# EAGLE design eGH (EAGLE 9.6.2)
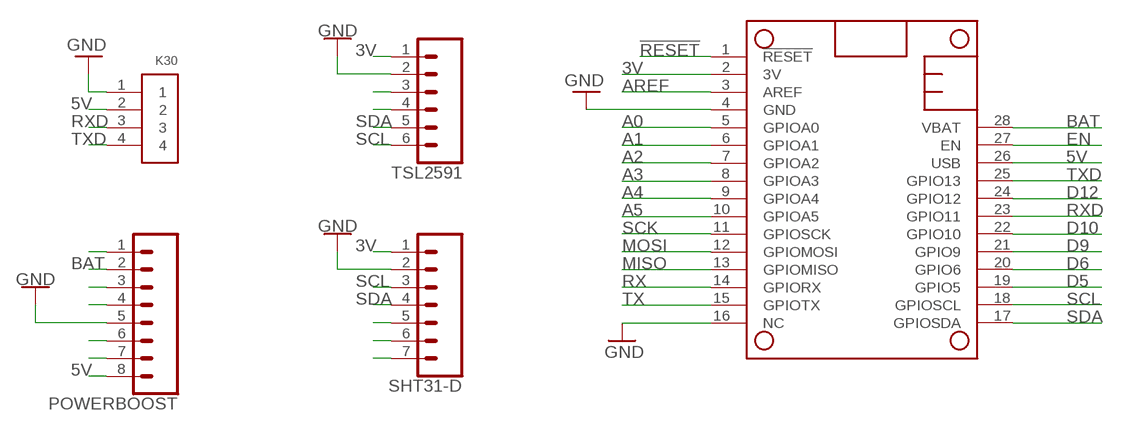
[diagram p0: schematic, sheet 1]

## Parts
K30  1X4-BIG  [1X04-BIG]
MS1  FEATHERWING  [FEATHERWING]
POWERBOOST  CONN_08"  [1X08]
SHT31-D  CONN_07  [1X07]
TSL2591  CONN_06SILK_FEMALE_PTH  [1X06]

## Nets
3V: MS1.2(3V) SHT31-D.1 TSL2591.1
5V [Power]: K30.2 MS1.26(USB) POWERBOOST.8
!RESET: MS1.1(!RESET)
A0: MS1.5(GPIOA0)
A1: MS1.6(GPIOA1)
A2: MS1.7(GPIOA2)
A3: MS1.8(GPIOA3)
A4: MS1.9(GPIOA4)
A5: MS1.10(GPIOA5)
AREF: MS1.3(AREF)
BAT: MS1.28(VBAT) POWERBOOST.2
D5: MS1.19(GPIO5)
D6: MS1.20(GPIO6)
D9: MS1.21(GPIO9)
D10: MS1.22(GPIO10)
D12: MS1.24(GPIO12)
EN: MS1.27(EN)
GND [Power]: K30.1 MS1.4(GND) POWERBOOST.5 SHT31-D.2 TSL2591.2
MISO: MS1.13(GPIOMISO)
MOSI: MS1.12(GPIOMOSI)
N$1: POWERBOOST.1
N$2: MS1.16(NC) ; supply symbol labelled GND
N$3: TSL2591.3
N$4: TSL2591.4
N$5: POWERBOOST.3
N$6: POWERBOOST.4
N$7: SHT31-D.5
N$8: SHT31-D.6
N$9: SHT31-D.7
N$11: POWERBOOST.6
N$12: POWERBOOST.7
RX: MS1.14(GPIORX)
RXD: K30.3 MS1.23(GPIO11)
SCK: MS1.11(GPIOSCK)
SCL: MS1.18(GPIOSCL) SHT31-D.3 TSL2591.6
SDA: MS1.17(GPIOSDA) SHT31-D.4 TSL2591.5
TX: MS1.15(GPIOTX)
TXD: K30.4 MS1.25(GPIO13)

## Library data of the parts
K30 = adafruit:1X4: 4-pin connector
MS1 = adafruit:FEATHERWING
POWERBOOST = SparkFun-Connectors:CONN_08: Multi connection point. Often used as Generic Header-pin footprint for 0.1 inch spaced/style header connections On any of the 0.1 inch spaced packages, you can populate with these: Break Away Headers - Straight <https://www.sparkfun.com/products/116> (PRT-00116) Break Away Male Headers - Right Angle <https://www.sparkfun.com/products/553> (PRT-00553) Female Headers <https://www.sparkfun.com/products/115> (PRT-00115) Break Away Headers - Machine Pin <https://www.sparkfun.com/products/117> (PRT-00117) Break Away Female Headers - Swiss Machine Pin <https://www.sparkfun.com/products/743> (PRT-00743) Arduino Stackable Header - 8 Pin <https://www.sparkfun.com/products/9279> (PRT-09279) For SCREWTERMINALS and SPRING TERMINALS visit here: Screw Terimnals on SparkFun.com <https://www.sparkfun.com/search/results?term=Screw+Terminals> (5mm/3.5mm/2.54mm spacing) This device is also useful as a general connection point to wire up your design to another part of your project. Our various solder wires solder well into these plated through hole pads. Hook-Up Wire - Assortment (Stranded, 22 AWG) <https://www.sparkfun.com/products/11375> (PRT-11375) Hook-Up Wire - Assortment (Solid Core, 22 AWG) <https://www.sparkfun.com/products/11367> (PRT-11367) View the entire wire category on our website here <https://www.sparkfun.com/categories/141> Special notes: Molex polarized connector foot print use with SKU : PRT-08231 with associated crimp pins and housings. 1MM SMD Version SKU: PRT-10208 NOTES ON THE VARIANTS LOCK and LOCK_LONGPADS... This footprint was designed to help hold the alignment of a through-hole component (i.e. 6-pin header) while soldering it into place. You may notice that each hole has been shifted either up or down by 0.005 of an inch from it's more standard position (which is a perfectly straight line). This slight alteration caused the pins (the squares in the middle) to touch the edges of the holes. Because they are alternating, it causes a "brace" to hold the component in place. 0.005 has proven to be the perfect amount of "off-center" position when using our standard breakaway headers. Although looks a little odd when you look at the bare footprint, once you have a header in there, the alteration is very hard to notice. Also,if you push a header all the way into place, it is covered up entirely on the bottom side.; PROD_ID: CONN-08438
SHT31-D = SparkFun-Connectors:CONN_07: Multi connection point. Often used as Generic Header-pin footprint for 0.1 inch spaced/style header connections On any of the 0.1 inch spaced packages, you can populate with these: Break Away Headers - Straight <https://www.sparkfun.com/products/116> (PRT-00116) Break Away Male Headers - Right Angle <https://www.sparkfun.com/products/553> (PRT-00553) Female Headers <https://www.sparkfun.com/products/115> (PRT-00115) Break Away Headers - Machine Pin <https://www.sparkfun.com/products/117> (PRT-00117) Break Away Female Headers - Swiss Machine Pin <https://www.sparkfun.com/products/743> (PRT-00743) For SCREWTERMINALS and SPRING TERMINALS visit here: Screw Terimnals on SparkFun.com <https://www.sparkfun.com/search/results?term=Screw+Terminals> (5mm/3.5mm/2.54mm spacing) This device is also useful as a general connection point to wire up your design to another part of your project. Our various solder wires solder well into these plated through hole pads. Hook-Up Wire - Assortment (Stranded, 22 AWG) <https://www.sparkfun.com/products/11375> (PRT-11375) Hook-Up Wire - Assortment (Solid Core, 22 AWG) <https://www.sparkfun.com/products/11367> (PRT-11367) View the entire wire category on our website here <https://www.sparkfun.com/categories/141> Special notes: Molex polarized connector foot print use with SKU : PRT-08231 with associated crimp pins and housings. 1MM SMD Version SKU: PRT-10208 NOTES ON THE VARIANTS LOCK and LOCK_LONGPADS... This footprint was designed to help hold the alignment of a through-hole component (i.e. 6-pin header) while soldering it into place. You may notice that each hole has been shifted either up or down by 0.005 of an inch from it's more standard position (which is a perfectly straight line). This slight alteration caused the pins (the squares in the middle) to touch the edges of the holes. Because they are alternating, it causes a "brace" to hold the component in place. 0.005 has proven to be the perfect amount of "off-center" position when using our standard breakaway headers. Although looks a little odd when you look at the bare footprint, once you have a header in there, the alteration is very hard to notice. Also,if you push a header all the way into place, it is covered up entirely on the bottom side.
TSL2591 = SparkFun-Connectors:CONN_06: Multi connection point. Often used as Generic Header-pin footprint for 0.1 inch spaced/style header connections On any of the 0.1 inch spaced packages, you can populate with these: Break Away Headers - Straight <https://www.sparkfun.com/products/116> (PRT-00116) Break Away Male Headers - Right Angle <https://www.sparkfun.com/products/553> (PRT-00553) Female Headers <https://www.sparkfun.com/products/115> (PRT-00115) Break Away Headers - Machine Pin <https://www.sparkfun.com/products/117> (PRT-00117) Break Away Female Headers - Swiss Machine Pin <https://www.sparkfun.com/products/743> (PRT-00743) Arduino Stackable Header - 6 Pin <https://www.sparkfun.com/products/9280> (PRT-09280) For SCREWTERMINALS and SPRING TERMINALS visit here: Screw Terimnals on SparkFun.com <https://www.sparkfun.com/search/results?term=Screw+Terminals> (5mm/3.5mm/2.54mm spacing) This device is also useful as a general connection point to wire up your design to another part of your project. Our various solder wires solder well into these plated through hole pads. Hook-Up Wire - Assortment (Stranded, 22 AWG) <https://www.sparkfun.com/products/11375> (PRT-11375) Hook-Up Wire - Assortment (Solid Core, 22 AWG) <https://www.sparkfun.com/products/11367> (PRT-11367) View the entire wire category on our website here <https://www.sparkfun.com/categories/141>; PROD_ID: CONN-08437

## Net classes
1 Power: width 0.3 mm

## Board
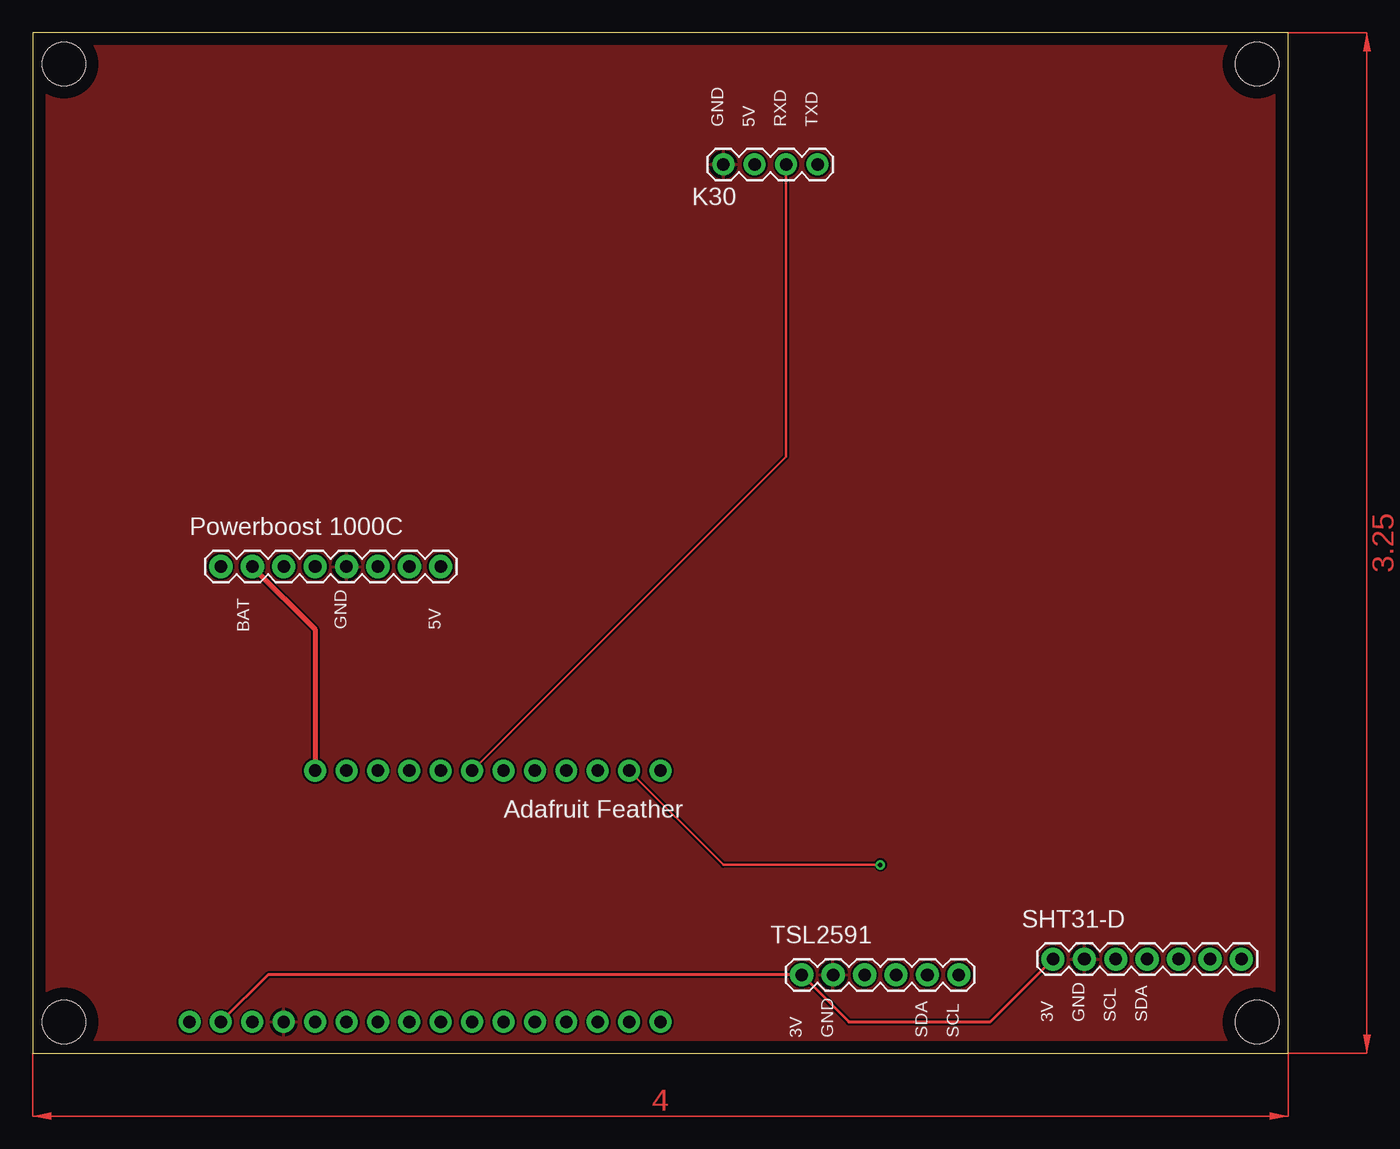
[diagram p1: board, top side]
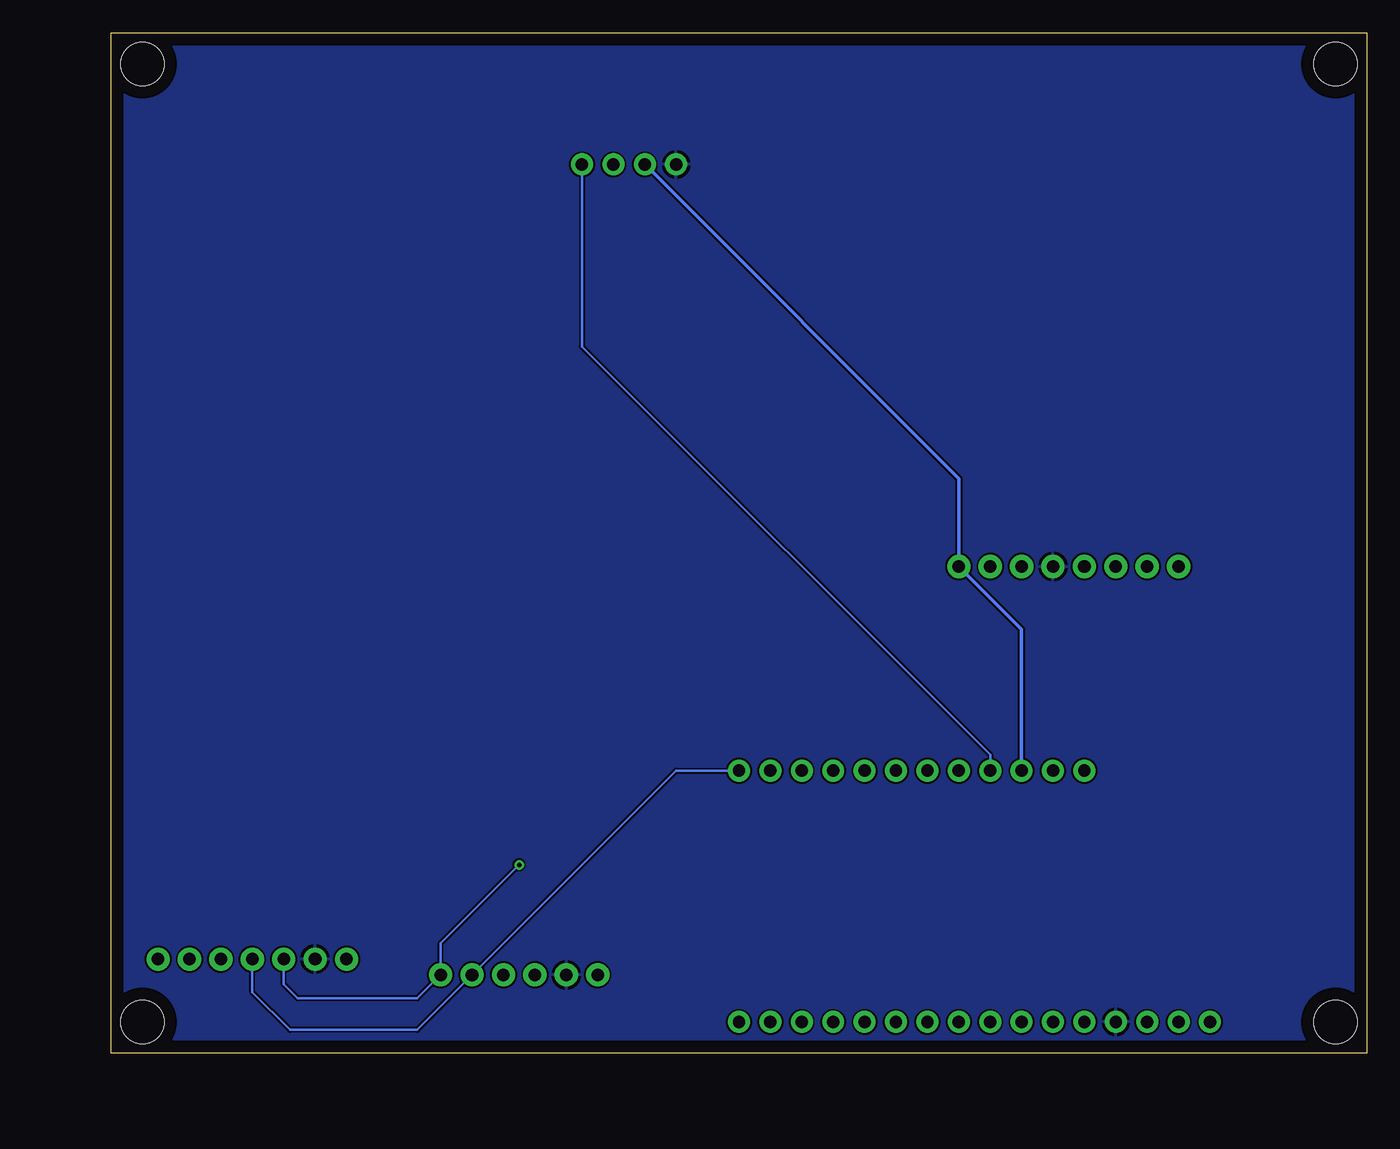
[diagram p2: board, bottom side, seen from below]

Size 101.6 x 82.55 mm. Coordinates in mm from the lower left corner, seen from the top.
Outline: 0,0 101.6,0 101.6,82.55 0,82.55 0,0
Copper layers (1*16): Top 0.035mm / dielectric 1.5mm / Bottom 0.035mm
Design rules "default *": minimum track width 6mil, minimum drill 0.35mm, track to track 6mil, track to pad 6mil, pad to pad 6mil, via to via 6mil, smd to smd 6mil, copper to edge 40mil, drill to drill 6mil, minimum pad ring 10mil, minimum via ring 8mil, stop-mask expansion 4mil, vias tented up to drill 35mil, thermal gap 10mil
Holes 3.5 mm at 99.06,2.54 2.54,2.54 2.54,80.01 99.06,80.01

### Footprints (pad centres in the part's own frame; a part is rotated, then mirrored left to right if it is on the bottom)
1X04-BIG = drill 1.016 pad 1.778: 1 0,0; 2 2.54,0; 3 5.08,0; 4 7.62,0
FEATHERWING = drill 1 pad 1.778: 1 6.35,1.27; 2 8.89,1.27; 3 11.43,1.27; 4 13.97,1.27; 5 16.51,1.27; 6 19.05,1.27; 7 21.59,1.27; 8 24.13,1.27; 9 26.67,1.27; 10 29.21,1.27; 11 31.75,1.27; 12 34.29,1.27; 13 36.83,1.27; 14 39.37,1.27; 15 41.91,1.27; 16 44.45,1.27; 17 44.45,21.59; 18 41.91,21.59; 19 39.37,21.59; 20 36.83,21.59; 21 34.29,21.59; 22 31.75,21.59; 23 29.21,21.59; 24 26.67,21.59; 25 24.13,21.59; 26 21.59,21.59; 27 19.05,21.59; 28 16.51,21.59
1X08 = drill 1.016 pad 1.88: 1 0,0; 2 2.54,0; 3 5.08,0; 4 7.62,0; 5 10.16,0; 6 12.7,0; 7 15.24,0; 8 17.78,0
1X07 = drill 1.016 pad 1.88: 1 0,0; 2 2.54,0; 3 5.08,0; 4 7.62,0; 5 10.16,0; 6 12.7,0; 7 15.24,0
1X06 = drill 1.016 pad 1.88: 1 0,0; 2 2.54,0; 3 5.08,0; 4 7.62,0; 5 10.16,0; 6 12.7,0

### Placement (x,y rotation side)
K30  55.88,71.88 0 top
MS1  6.35,1.27 0 top
POWERBOOST  15.24,39.37 0 top
SHT31-D  82.55,7.62 0 top
TSL2591  62.23,6.35 0 top

### Tracks (layer width: path | path; a pad name or v marks a point on that pad's centre or on a via)
3V
  Top 0.254: SHT31-D.1 77.47,2.54 66.04,2.54 TSL2591.1 19.05,6.35 MS1.2
5V
  Bottom 0.3: K30.2 33.02,46.48 POWERBOOST.8 27.94,34.29 MS1.26
BAT
  Top 0.406: POWERBOOST.2 22.86,34.29 MS1.28
GND
  pour Top: 0,0 0,82.55 101.6,82.55 101.6,0
  pour Bottom: 0,82.55 101.6,82.55 101.6,0 0,0
RXD
  Top 0.2: K30.3 60.96,48.26 MS1.23
SCL  (via drill 0.35)
  Top 0.2: MS1.18 55.88,15.24 v68.58,15.24
  Bottom 0.2: SHT31-D.3 87.63,5.59 86.49,4.45 76.83,4.45 TSL2591.6 74.93,8.89 v68.58,15.24
SDA
  Bottom 0.2: SHT31-D.4 90.17,4.95 87.12,1.91 76.83,1.91 TSL2591.5 55.88,22.86 MS1.17
TXD
  Bottom 0.2: K30.4 63.5,57.15 30.48,24.13 MS1.25
(copper drawn outside any net)
  shapes: Top area x2

### Text on the board
tPlace: GND | 5V | RXD | TXD | K30 | Powerboost 1000C | BAT | GND | 5V | Adafruit Feather | SHT31-D | TSL2591 | 3V | GND | SCL | SDA | 3V | GND | SDA | SCL